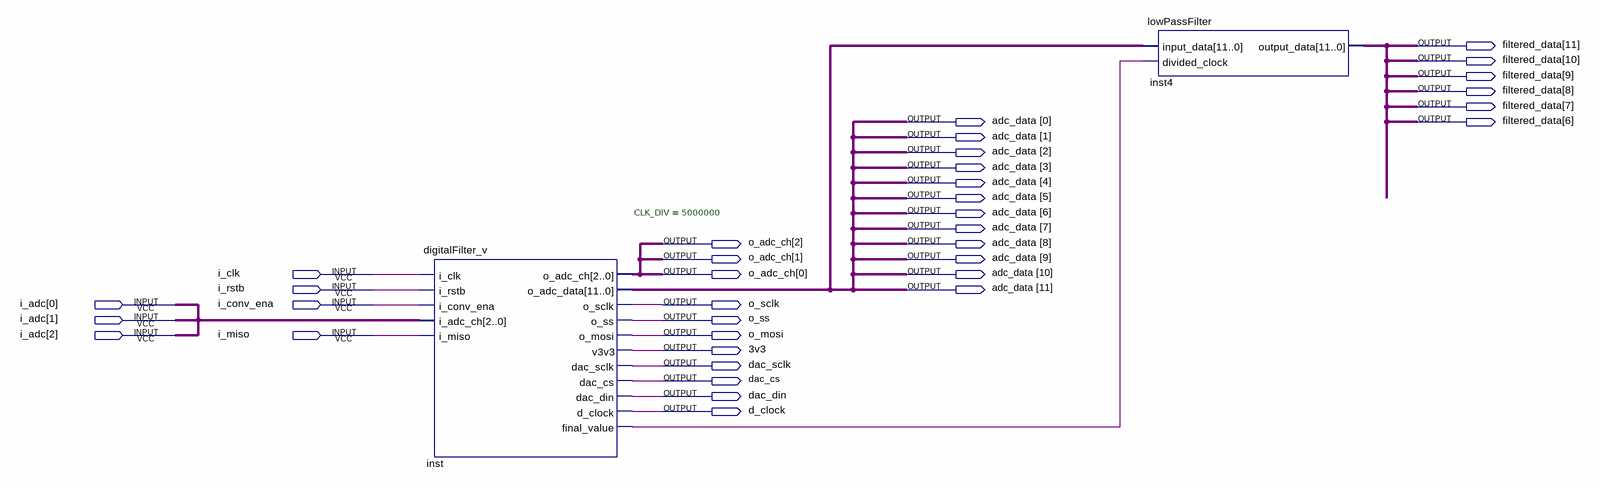
[diagram p0: schematic sheet]
// Quartus schematic digitalFilter.bdf as structural Verilog: 2 symbols, 36 pins
module digitalFilter (
  input  i_clk,
  input  i_rstb,
  input  [2:0] i_adc,
  input  i_conv_ena,
  input  i_miso,
  output [11:0] filtered_data,
  output [11:0] adc_data,
  output [2:0] o_adc_ch,
  output o_sclk,
  output o_ss,
  output o_mosi,
  output \3v3 ,
  output dac_sclk,
  output dac_cs,
  output dac_din,
  output d_clock
);

  wire inst_final_value;

  digitalFilter_v #(.CLK_DIV(5000000)) inst (
    .i_clk(i_clk), .i_rstb(i_rstb), .i_conv_ena(i_conv_ena), .i_adc_ch({i_adc[0], i_adc[1], i_adc[2]}),
    .i_miso(i_miso), .o_adc_ch(o_adc_ch), .o_adc_data(adc_data), .o_sclk(o_sclk), .o_ss(o_ss),
    .o_mosi(o_mosi), .v3v3(\3v3 ), .dac_sclk(dac_sclk), .dac_cs(dac_cs), .dac_din(dac_din),
    .d_clock(d_clock), .final_value(inst_final_value));
  lowPassFilter inst4 (.input_data(adc_data), .divided_clock(inst_final_value), .output_data(filtered_data));

  // Other names for the same wires on the sheet: i_adc_ch[2:0] = {i_adc[0], i_adc[1], i_adc[2]}
endmodule
